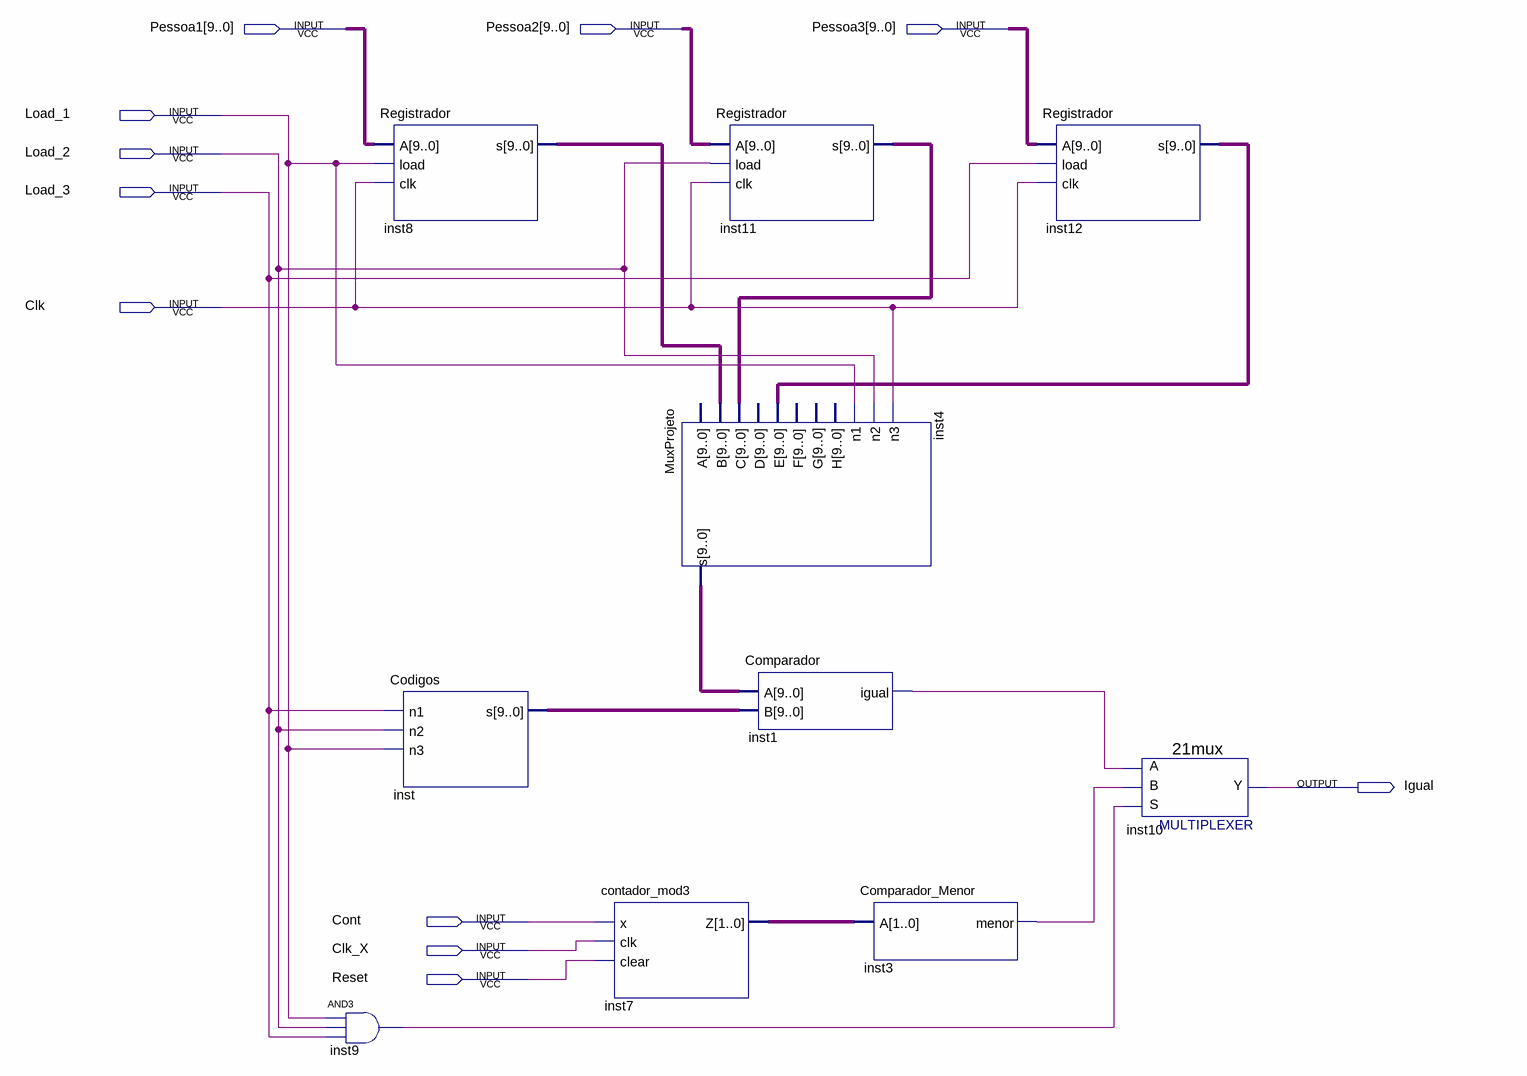
[diagram p0: schematic sheet]
// Quartus schematic CaminhoDados.bdf as structural Verilog: 10 symbols, 11 pins
module CaminhoDados (
  input  [9:0] Pessoa1,
  input  [9:0] Pessoa2,
  input  [9:0] Pessoa3,
  input  Load_1,
  input  Load_2,
  input  Load_3,
  input  Clk,
  input  Cont,
  input  Clk_X,
  input  Reset,
  output Igual
);

  wire inst1_igual, inst3_menor, inst9_out;
  wire [1:0] inst7_z;
  wire [9:0] inst4_s, inst8_s, inst11_s, inst12_s, inst_s;

  and inst9 (inst9_out, Load_1, Load_2, Load_3);
  Registrador inst8 (.A(Pessoa1), .load(Load_1), .clk(Clk), .s(inst8_s));
  Codigos inst (.n1(Load_3), .n2(Load_2), .n3(Load_1), .s(inst_s));
  contador_mod3 inst7 (.x(Cont), .clk(Clk_X), .clear(Reset), .Z(inst7_z));
  Registrador inst11 (.A(Pessoa2), .load(Load_2), .clk(Clk), .s(inst11_s));
  MuxProjeto inst4 (
    .B(inst8_s), .C(inst11_s), .E(inst12_s), .n1(Load_1), .n2(Load_2), .n3(Clk), .s(inst4_s));  // open: A, D, F, G, H
  Comparador inst1 (.A(inst4_s), .B(inst_s), .igual(inst1_igual));
  Comparador_Menor inst3 (.A(inst7_z), .menor(inst3_menor));
  Registrador inst12 (.A(Pessoa3), .load(Load_3), .clk(Clk), .s(inst12_s));
  \21mux  inst10 (.S(inst9_out), .B(inst3_menor), .A(inst1_igual), .Y(Igual));
endmodule
